# EAGLE design eeZee_microSD (EAGLE 7.1.0)
DATABASE: ./../../../eagle/PARTSDB.TXT
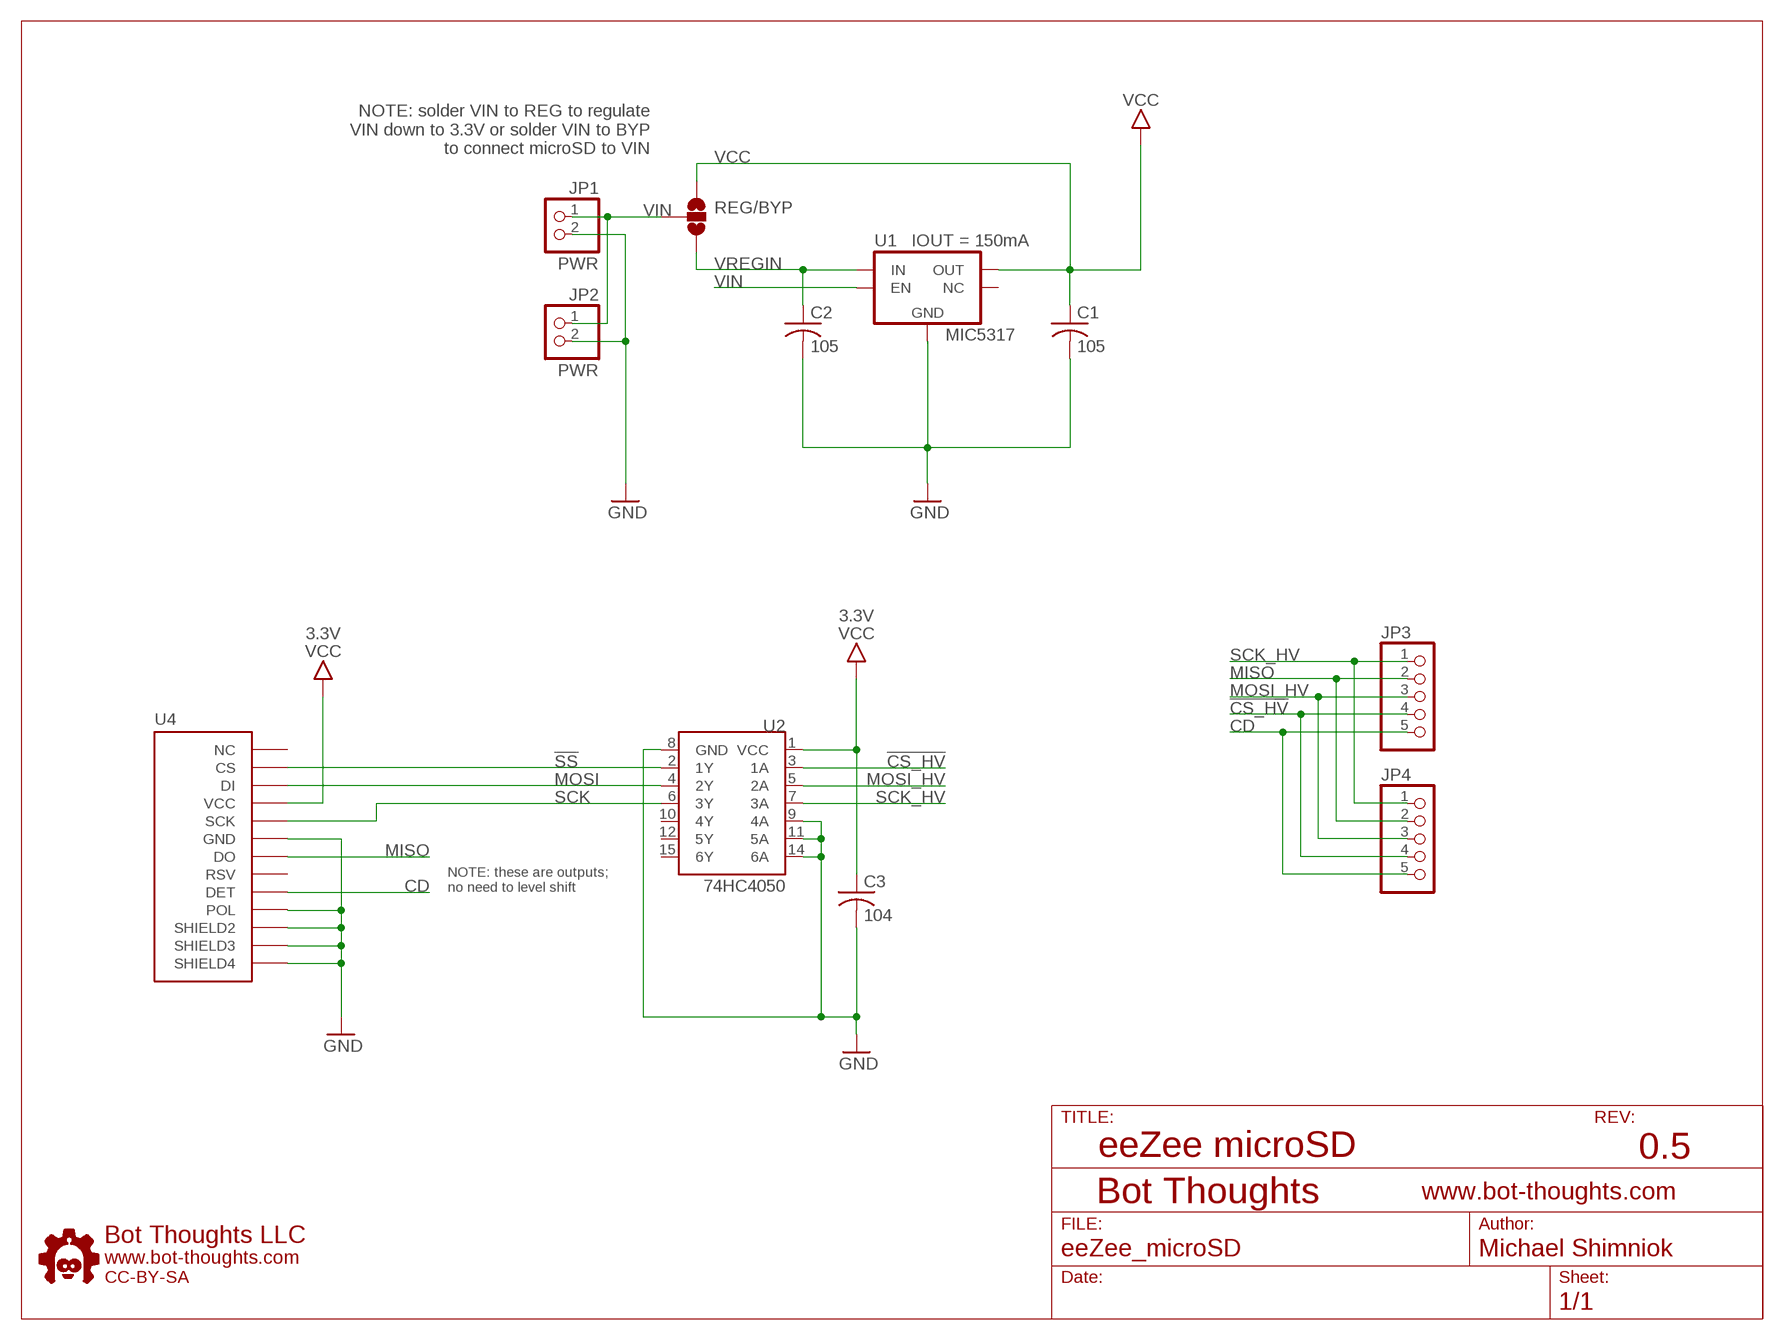
[diagram p0: schematic, sheet 1]

## Parts
C1  105  C-0603  [0603]
C2  105  C-0603  [0603]
C3  104  C-USC0603  [C0603]
JP1  PWR  PINHD-1X02_2.54-S  [1X02-S]
JP2  PWR  PINHD-1X02_2.54-S  [1X02-S]
JP3  PINHD-1X05_2.54-S  [1X05-S]
JP4  PINHD-1X05_2.54-S  [1X05-S]
REG/BYP  SOLDERJUMPER_2WAYS  [SJ_3]
U1  MIC5317  [SOT23-5]
U2  74HC4050  HEX_CONVERTER  [SO016]
U4  MICROSD_CD  [USD_SMALL]
U$5  BTLOGO-LOGO-SM  [BTLOGOS]

## Nets
!CS_HV: JP3.4 JP4.4 U2.3(1A)
!SS: U2.2(1Y) U4.2(CS)
CD: JP3.5 JP4.5 U4.DET
GND: C1.2(-) C2.2(-) C3.2 JP1.2 JP2.2 U1.2(GND) U2.8(GND) U2.9(4A) U2.11(5A) U2.14(6A) U4.6(GND) U4.GND1(SHIELD2) U4.GND3(SHIELD3) U4.GND4(SHIELD4) U4.POL
MISO: JP3.2 JP4.2 U4.7(DO)
MOSI: U2.4(2Y) U4.3(DI)
MOSI_HV: JP3.3 JP4.3 U2.5(2A)
SCK: U2.6(3Y) U4.5(SCK)
SCK_HV: JP3.1 JP4.1 U2.7(3A)
VCC: C1.1(+) C3.1 REG/BYP.1 U1.5(OUT) U2.1(VCC) U4.4(VCC) ; supply symbol labelled 3.3V
VIN: JP1.1 JP2.1 REG/BYP.2 U1.3(EN)
VREGIN: C2.1(+) REG/BYP.3 U1.1(IN)
Unconnected: U1.4(NC) U2.10(4Y) U2.12(5Y) U2.15(6Y) U4.1(NC) U4.8(RSV)

## Notes on the sheet
- NOTE: solder VIN to REG to regulate
  VIN down to 3.3V or solder VIN to BYP
  to connect microSD to VIN
- NOTE: these are outputs;
  no need to level shift
- eeZee microSD | 0.5

## Library data of the parts
C1 C2 = bt_rcl:C: Capacitor, non-polarized, American symbol; PARTNO: LMK107B7105KA-T
C3 = rcl:C-US: CAPACITOR, American symbol; PARTNO: LMK107B7105KA-T
JP1 JP2 = pinhead-2:PINHD-1X02: PIN HEADER
JP3 JP4 = pinhead-2:PINHD-1X05: PIN HEADER
REG/BYP = SparkFun:SOLDERJUMPER_2WAY: Solder Jumper 2 way solder jumper
U1 = bt_regulator:MIC5317: MIC5317 150 mA LDO Voltage Regulator The MIC5317 is a high performance 150 mA low dropout regulator that offers high power supply rejection (PSRR) in an ultra-small 1 mm x 1 mm package for stringent space requirements and demanding performance. The MIC5317 operates from an input voltage from 2.5V to 6.0V and is capable of providing the output voltages of 1.0V to 3.6V making it ideal for USB port or 6V AC adapter applications. Datasheet.pdf <http://ww1.microchip.com/downloads/en/DeviceDoc/22070a.pdf>; IOUT: 150mA; PARTNO: MIC5317-3.3YM5-TR; VOUT: 3.3V
U2 = SparkFun:HEX_CONVERTER
U4 = bt_electromech:MICROSD_CD: MicroSD Card Socket with Card Detect
U$5 = bt:BTLOGO: Bot Thoughts Logo

## Board
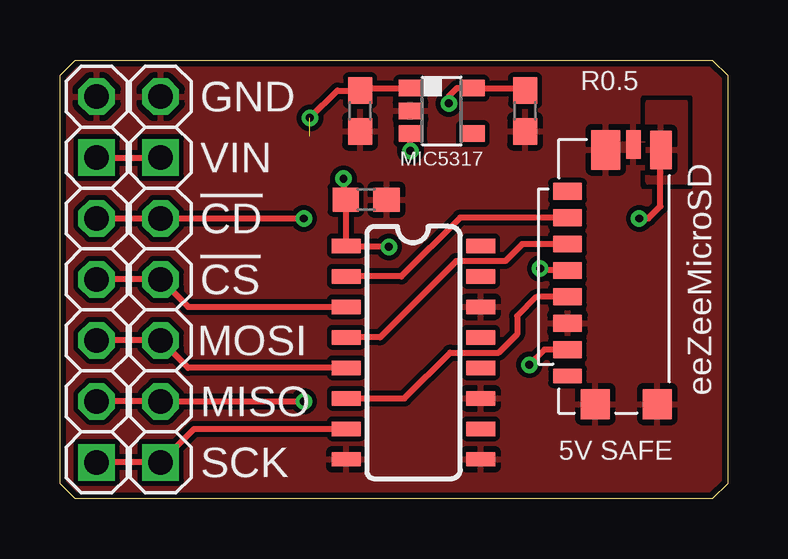
[diagram p1: board, top side]
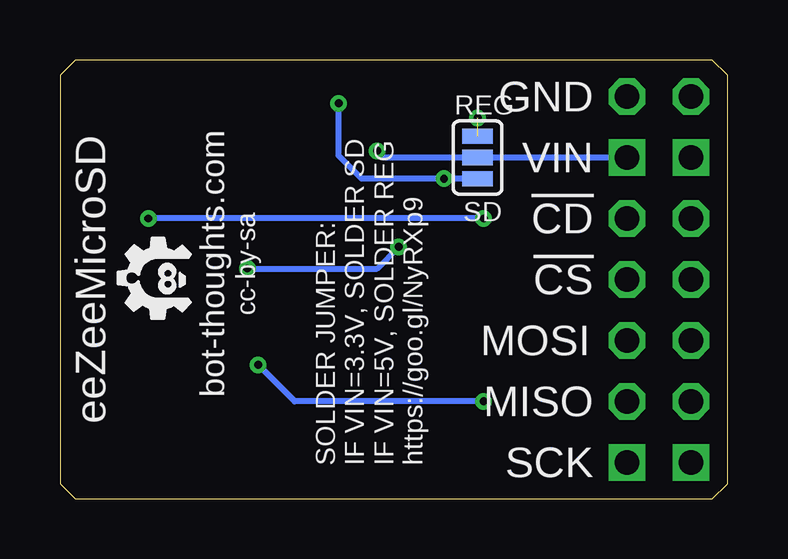
[diagram p2: board, bottom side, seen from below]

Size 27.81 x 18.29 mm. Coordinates in mm from the lower left corner, seen from the top.
Outline: 27.81,17.65 27.81,0.64 27.18,0 0.64,0 0,0.64 0,17.65 0.64,18.29 27.18,18.29 27.81,17.65
Copper layers (1*16): Top 0.0356mm / dielectric 1.5011mm / Bottom 0.0356mm
Design rules "LaenPCBOrder *": minimum track width 6mil, minimum drill 13mil, track to track 8mil, track to pad 8mil, pad to pad 8mil, via to via 8mil, smd to smd 8mil, copper to edge 10mil, drill to drill 10mil, minimum pad ring 7mil, minimum via ring 7mil, stop-mask expansion 3mil, vias tented up to drill 20mil, thermal gap 10mil

### Footprints (pad centres in the part's own frame; a part is rotated, then mirrored left to right if it is on the bottom)
0603 = smd 1.1 x 1: 1 -0.85,0; 2 0.85,0
C0603 = smd 1.1 x 1: 1 -0.85,0; 2 0.85,0
1X02-S = drill 1.016 square: 1 -1.27,0 | drill 1.016 octagon: 2 1.27,0
1X05-S = drill 1.016 square: 1 -5.08,0 | drill 1.016 octagon: 2 -2.54,0; 3 0,0; 4 2.54,0; 5 5.08,0
SJ_3 = smd 0.635 x 1.27: 1 -0.889,0; 2 0,0; 3 0.889,0
SOT23-5 = smd 0.69 x 0.99: 1 -0.95,-1.3; 2 0,-1.3; 3 0.95,-1.3; 4 0.95,1.3; 5 -0.95,1.3
SO016 = smd 0.6 x 1.2: 1 -4.445,-2.8; 2 -3.175,-2.8; 3 -1.905,-2.8; 4 -0.635,-2.8; 5 0.635,-2.8; 6 1.905,-2.8; 7 3.175,-2.8; 8 4.445,-2.8; 9 4.445,2.8; 10 3.175,2.8; 11 1.905,2.8; 12 0.635,2.8; 13 -0.635,2.8; 14 -1.905,2.8; 15 -3.175,2.8; 16 -4.445,2.8
USD_SMALL = smd 0.7 x 1.2: 1 3.55,-1.21; 2 2.45,-1.21; 3 1.35,-1.21; 4 0.25,-1.21; 5 -0.85,-1.21; 6 -1.95,-1.21; 7 -3.05,-1.21 | smd 0.6 x 1.2: 8 -4.15,-1.21 | smd 1.6 x 0.9: DET 5.275,-5.1 | smd 1.25 x 1.2: GND1 -5.325,-4.95; GND4 -5.325,-2.36 | smd 1.65 x 1.2: GND3 5.275,-2.8 | smd 1.2 x 0.6: POL 5.5,-3.95

### Placement (x,y rotation side)
C1  19.38,16.17 270 top
C2  12.5,16.17 270 top
C3  12.76,12.47 0 top
JP1  4.19,15.49 90 top
JP2  1.52,15.49 90 top
JP3  1.52,6.6 90 top
JP4  4.19,6.6 90 top
REG/BYP  10.41,14.22 90 bottom
U1  15.9,16.17 270 top
U2  14.73,6.1 270 top
U4  19.94,9.27 90 top
U$5  22.23,9.14 90 bottom

### Tracks (layer width: path | path; a pad name or v marks a point on that pad's centre or on a via)
!CS_HV
  Top 0.254: U2.3 5.33,8 JP4.4 JP3.4
!SS
  Top 0.254: U2.2 14.22,9.27 16.67,11.72 U4.2
CD  (via drill 0.33)
  Top 0.254: JP3.5 JP4.5 v10.16,11.68 | U4.DET 25.02,14.83 25.02,12.19 24.51,11.68 v24.13,11.68
  Bottom 0.254: v10.16,11.68 v24.13,11.68
  pour Top: 26.04,16.51 26.04,13.21 24.51,13.21 24.51,16.51
GND
  pour Top (rank 3): 0.64,0 27.18,0 27.81,0.64 27.81,17.65 27.18,18.29 0.64,18.29 0,17.65 0,0.64
MISO  (via drill 0.33)
  Top 0.254: JP3.2 JP4.2 v10.16,4.06 | v19.56,5.59 20.19,6.22 U4.7
  Bottom 0.254: v10.16,4.06 18.03,4.06 v19.56,5.59
MOSI
  Top 0.254: U2.4 13.34,6.73 16.51,9.91 18.54,9.91 19.26,10.62 U4.3
MOSI_HV
  Top 0.254: U2.5 5.33,5.46 JP4.3 JP3.3
SCK
  Top 0.254: U2.6 14.35,4.19 16.26,6.1 18.29,6.1 19.05,6.86 19.05,7.62 19.85,8.42 U4.5
SCK_HV
  Top 0.254: U2.7 5.59,2.92 JP4.1 JP3.1
VCC  (via drill 0.33)
  Top 0.254: v16.2,16.48 16.2,16.78 16.54,17.12 U1.5 19.28,17.12 C1.1 | U4.4 20.09,9.52 v20.01,9.6 | v13.7,10.5 11.97,10.5 U2.1 11.93,12.12 C3.1 11.81,12.45 v11.81,13.35
  Bottom 0.254: REG/BYP.1 v11.81,13.35 15.25,13.35 16.2,14.3 v16.2,16.48 | v20.01,9.6 14.6,9.6 v13.7,10.5
VIN  (via drill 0.33)
  Top 0.254: JP2.1 JP1.1 | v14.6,14.5 U1.3
  Bottom 0.254: JP1.1 REG/BYP.2 14.32,14.22 v14.6,14.5
VREGIN  (via drill 0.33)  (1 unrouted)
  Top 0.254: v10.41,15.88 11.56,17.02 C2.1 13,17.12 U1.1

### Text on the board
tNames: GND | R0.5 | VIN | !CD | !CS | eeZeeMicroSD | MOSI | MISO | SCK | 5V SAFE
bNames: GND | REG | VIN | !CD | SD | cc-by-sa | bot-thoughts.com | !CS | eeZeeMicroSD | MOSI | MISO | SCK | SOLDER JUMPER: / IF VIN=3.3V, SOLDER SD / IF VIN=5V, SOLDER REG / https://goo.gl/NyRXp9
tsilk: bot-thoughts.com | 5V SAFE | eeZee microSD | GND | VCC | D13 | D12 | D11 | D10 | D9 | VIN | GND
bsilk: R0.3A | 74HC4050 | 104 | 106 | 104 | 10K | MCP1824S | REG | BYP | CC-BY-SA | SCK | MISO | MOSI | !CS | VIN | GND